# Altium schematic sheet FPGA programming.SchDoc: FPGA Configuration
size A4; Organization: Blinkinlabs, LLC; DocumentNumber: 12; SheetNumber: 13; SheetTotal: 14
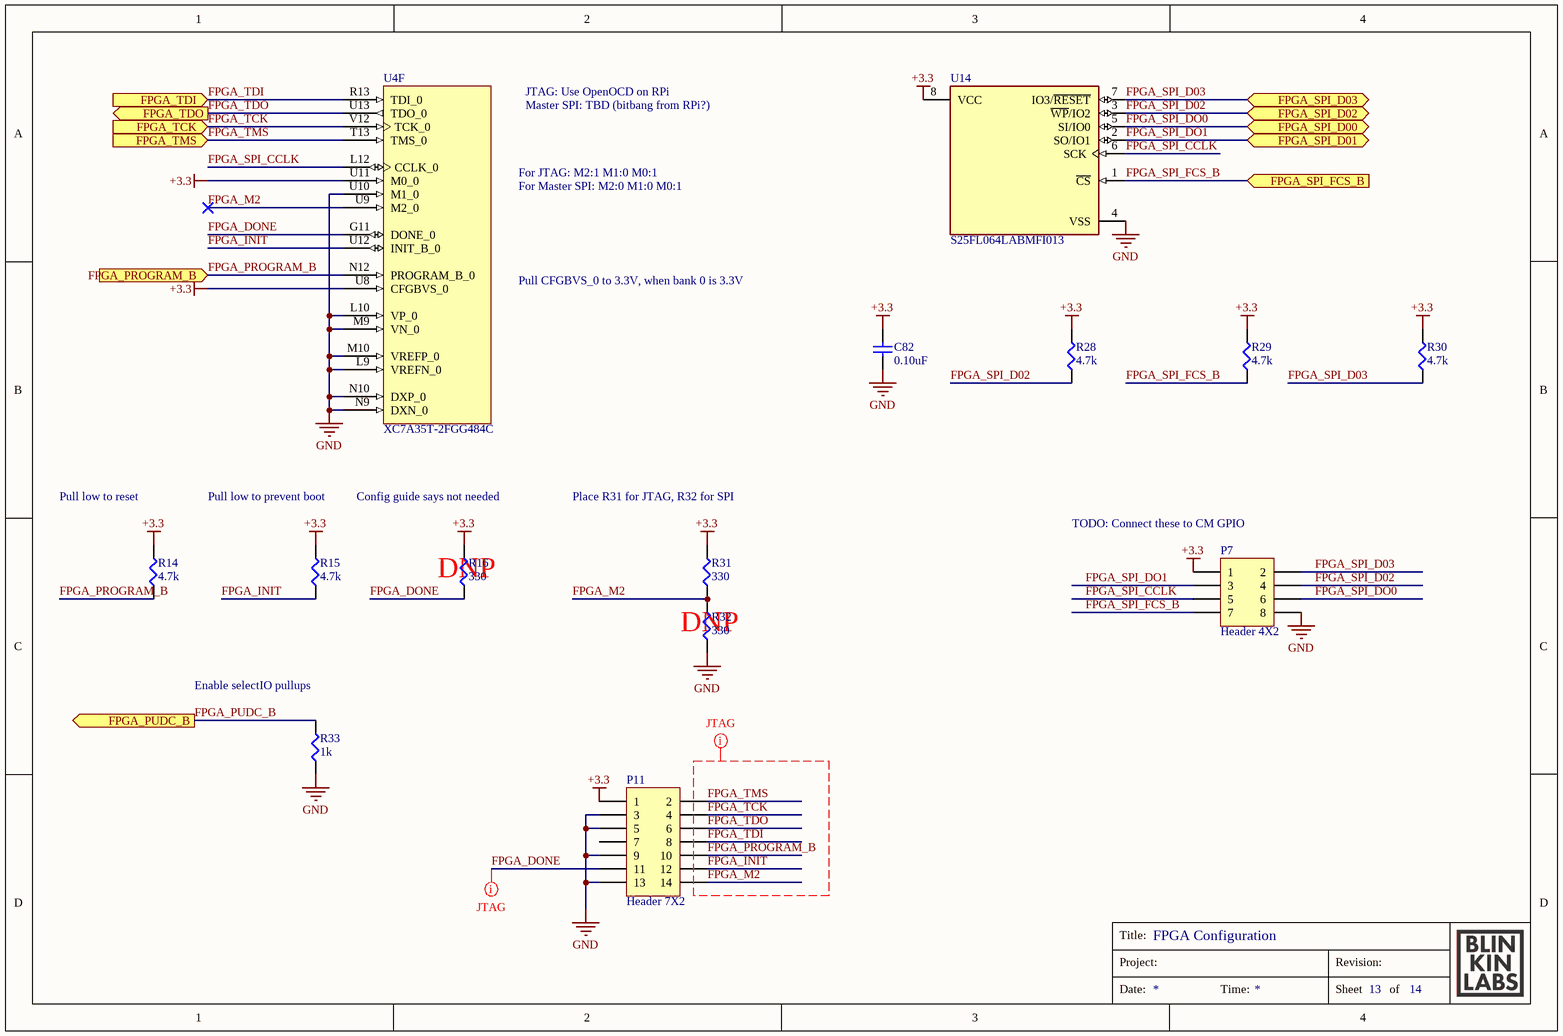
[diagram p0: FPGA programming.SchDoc]

## Parts
C82  0.10uF  [CAPC1005X06L]
P7  Header 4X2  [HDR2X4]
P11  Header 7X2  [HDR2X7]
R14  4.7k  [ERJ2G(0402)_L]
R15  4.7k  [ERJ2G(0402)_L]
R16  330  [ERJ2G(0402)_L]
R28  4.7k  [ERJ2G(0402)_L]
R29  4.7k  [ERJ2G(0402)_L]
R30  4.7k  [ERJ2G(0402)_L]
R31  330  [ERJ2G(0402)_L]
R32  330  [ERJ2G(0402)_L]
R33  1k  [ERJ2G(0402)_L]
U4  XC7A35T-2FGG484C  [FGG484]  (part F of 12)
U14  S25FL064LABMFI013  [FP-002-15548-MFG]

## Ports
FPGA_PROGRAM_B (in), FPGA_PUDC_B (out), FPGA_SPI_D00 (bidir), FPGA_SPI_D01 (bidir), FPGA_SPI_D02 (bidir), FPGA_SPI_D03 (bidir), FPGA_SPI_FCS_B (in), FPGA_TCK (in), FPGA_TDI (in), FPGA_TDO (out), FPGA_TMS (in)

## Nets
+3.3: C82.2 P7.1 P11.1 R14.2 R15.2 R16.2 R28.2 R29.2 R30.2 R31.2 U4.U8(CFGBVS_0) U4.U11(M0_0) U14.8(VCC)
GND: C82.1 P7.8 P11.3 P11.5 P11.9 P11.13 R32.1 R33.1 U4.L9(VREFN_0) U4.L10(VP_0) U4.M9(VN_0) U4.M10(VREFP_0) U4.N9(DXN_0) U4.N10(DXP_0) U4.U10(M1_0) U14.4(VSS)
FPGA_DONE: P11.11 R16.1 U4.G11(DONE_0)
FPGA_INIT: P11.12 R15.1 U4.U12(INIT_B_0)
FPGA_M2: P11.14 R31.1 R32.2 U4.U9(M2_0)
FPGA_PROGRAM_B: P11.10 R14.1 U4.N12(PROGRAM_B_0) ; port FPGA_PROGRAM_B
FPGA_PUDC_B: R33.2 ; port FPGA_PUDC_B
FPGA_SPI_CCLK: P7.5 U4.L12(CCLK_0) U14.6(SCK)
FPGA_SPI_D02: P7.4 R28.1 U14.3(~{WP}/IO2) ; port FPGA_SPI_D02
FPGA_SPI_D03: P7.2 R30.1 U14.7(IO3/~{RESET}) ; port FPGA_SPI_D03
FPGA_SPI_DO0: P7.6 U14.5(SI/IO0) ; port FPGA_SPI_D00
FPGA_SPI_DO1: P7.3 U14.2(SO/IO1) ; port FPGA_SPI_D01
FPGA_SPI_FCS_B: P7.7 R29.1 U14.1(~{CS}) ; port FPGA_SPI_FCS_B
FPGA_TCK: P11.4 U4.V12(TCK_0) ; port FPGA_TCK
FPGA_TDI: P11.8 U4.R13(TDI_0) ; port FPGA_TDI
FPGA_TDO: P11.6 U4.U13(TDO_0) ; port FPGA_TDO
FPGA_TMS: P11.2 U4.T13(TMS_0) ; port FPGA_TMS

Not connected (* = marked no-connect by the designer): P11 7

## Layout directives
net class JTAG: FPGA_DONE, FPGA_INIT, FPGA_M2, FPGA_PROGRAM_B, FPGA_TCK, FPGA_TDI, FPGA_TDO, FPGA_TMS

## Notes on the sheet
- JTAG: Use OpenOCD on RPi
- Master SPI: TBD (bitbang from RPi?)
- For JTAG: M2:1 M1:0 M0:1
- For Master SPI: M2:0 M1:0 M0:1
- Pull CFGBVS_0 to 3.3V, when bank 0 is 3.3V
- Pull low to reset
- Pull low to prevent boot
- Config guide says not needed
- Place R31 for JTAG, R32 for SPI
- (near R16) DNP
- (near P7) TODO: Connect these to CM GPIO
- (near R32) DNP
- (near R33) Enable selectIO pullups
- Title:
- Project:
- Revision:
- Date:
- Time:
- Sheet
- of

## Library data of the parts
C82 = GRM155R61A104KA01D: CAP CER 0.1UF 10V X5R 0402; Manufacturer: Murata Electronics North America; Tolerance: ±10%; PartNumber: GRM155R61A104KA01D; Datasheets: http://www.murata.com/~/media/webrenewal/support/library/catalog/products/capacitor/mlcc/c02e.pdf; Image: //media.digikey.com/Renders/Murata%20Renders/ZRB-SERIES-0402.jpg; Digi-Key Part Number: 490-1318-1-ND; Packaging: Cut Tape (CT); Series: GRM; Value: 0.10uF; Voltage: 10V; Temperature Coefficient: X5R; Operating Temperature: -55°C ~ 85°C; Features: -; Applications: General Purpose; Package / Case: 0402 (1005 Metric); Case/Package: 0402
P7 = Header 4X2: Header, 4-Pin, Dual row; LatestRevisionDate: 17-Jul-2002; LatestRevisionNote: Re-released for DXP Platform.; Publisher: Altium Limited
P11 = Header 7X2: Header, 7-Pin, Dual row; LatestRevisionDate: 17-Jul-2002; LatestRevisionNote: Re-released for DXP Platform.; Publisher: Altium Limited
R14 R15 R28-R30 = ERJ-PA2F4701X: RES SMD 4.7K OHM 1% 1/5W 0402; Manufacturer: Panasonic Electronic Components; Power (Watts): 0.2W, 1/5W; Temperature Coefficient: ±100ppm/°C; PartNumber: ERJ-PA2F4701X; Datasheets: https://industrial.panasonic.com/cdbs/www-data/pdf/RDA0000/AOA0000C243.pdf; Image: //media.digikey.com/Photos/Panasonic%20Photos/ERJ-PA2-Series.jpg; Digi-Key Part Number: P17228CT-ND; Series: ERJ; Value: 4.7k; Tolerance: ±1%; Composition: Thick Film; Features: Automotive AEC-Q200, Pulse Withstanding; Operating Temperature: -55°C ~ 155°C; Package / Case: 0402 (1005 Metric); Case/Package: 0402; Size / Dimension: 0.039" L x 0.020" W (1.00mm x 0.50mm); Height - Seated (Max): 0.016" (0.40mm); Number of Terminations: 2
R16 R31 R32 = ERJ-2RKF3300X: RES SMD 330 OHM 1% 1/10W 0402; Manufacturer: Panasonic Electronic Components; Power (Watts): 0.1W, 1/10W; Temperature Coefficient: ±100ppm/°C; PartNumber: ERJ-2RKF3300X; Datasheets: http://industrial.panasonic.com/www-cgi/jvcr13pz.cgi?E+PZ+3+AOA0002+ERJ2RKF3300X+7+WW; Image: //media.digikey.com/Photos/Panasonic%20Photos/ERJ-PA2-Series.jpg; Digi-Key Part Number: P330LCT-ND; Series: ERJ; Value: 330; Tolerance: ±1%; Composition: Thick Film; Features: Automotive AEC-Q200; Operating Temperature: -55°C ~ 155°C; Package / Case: 0402 (1005 Metric); Case/Package: 0402; Size / Dimension: 0.039" L x 0.020" W (1.00mm x 0.50mm); Height - Seated (Max): 0.016" (0.40mm); Number of Terminations: 2
R33 = ERJ-2RKF1001X: RES SMD 1K OHM 1% 1/10W 0402; Manufacturer: Panasonic Electronic Components; Power (Watts): 0.1W, 1/10W; Temperature Coefficient: ±100ppm/°C; PartNumber: ERJ-2RKF1001X; Datasheets: http://industrial.panasonic.com/www-cgi/jvcr13pz.cgi?E+PZ+3+AOA0002+ERJ2RKF1001X+7+WW; Image: //media.digikey.com/Photos/Panasonic%20Photos/ERJ-PA2-Series.jpg; Digi-Key Part Number: P1.00KLCT-ND; Series: ERJ; Value: 1k; Tolerance: ±1%; Composition: Thick Film; Features: Automotive AEC-Q200; Operating Temperature: -55°C ~ 155°C; Package / Case: 0402 (1005 Metric); Case/Package: 0402; Size / Dimension: 0.039" L x 0.020" W (1.00mm x 0.50mm); Height - Seated (Max): 0.016" (0.40mm); Number of Terminations: 2
U4 = CMP-0383-00019-1: Artix-7 FPGA, 250 User I/Os, 4 GTP, 484-Ball BGA, Speed Grade 2, Commercial Grade, Pb-Free; Manufacturer: Xilinx; Total Block RAM: 1800 Kb; GTP: 4; Available User I/O: 250; Speed Grades: 2; Logic Cells: 33280; CMTs: 5; ComponentLink3URL: http://www.xilinx.com/support/documentation/user_guides/ug475_7Series_Pkg_Pinout.pdf; PackageVersion: Rev. 1.11; ComponentLink2Description: Datasheet; ComponentLink3Description: Pinout; PartNumber: XC7A35T-2FGG484C; DatasheetVersion: Rev. 1.15; Operating Temperature Range: Commercial; PackageDescription: 484-Ball Wire-Bond Fine-Pitch BGA, Body 23 x 23 mm, Pitch 1 mm; ComponentLink4Description: Package Specification; Maximum Distributed RAM: 400 Kb; Mounting Technology: Surface Mount; ComponentLink2URL: http://www.xilinx.com/support/documentation/data_sheets/ds180_7Series_Overview.pdf; ComponentLink1Description: Manufacturer URL; ComponentLink4URL: http://www.xilinx.com/support/documentation/user_guides/ug475_7Series_Pkg_Pinout.pdf; PackageReference: FGG484; ComponentLink1URL: http://www.xilinx.com/
U14 = CMP-12948-000004-1: IC FLASH 64M SPI 108MHZ 8SOIC; Manufacturer: Cypress Semiconductor; Standoff Height: 0.05mm; Access Time: 8ns; Nominal Supply Current: 10-20mA; Max Supply Voltage: 3.6V; Memory Size: 64Mbits; Interface: SPI,Other; Memory Type: FLASH,NOR; Min Supply Voltage: 2.7V; Octopart: https://octopart.com/s25fl064labmfi013-cypress+semiconductor-81630477; Device Class L2: Memory; Frequency: 108MHz; Device Class L3: Flash; Digikey Description: IC FLASH 64M SPI 108MHZ 8SOIC; Device Class L1: Integrated Circuits (ICs); ComponentLink2URL: https://www.cypress.com/file/316661/download; ComponentLink2Description: Datasheet; Temperature Range High: +85°C; Temperature Range Low: -40°C; Ambient Temperature Range High: +85°C; Footprint Url: http://www.cypress.com/file/217366/download; RoHS: TRUE; Temperature: -40°C to +85°C; Package: 002-15548; Automotive: No; Lead Free: Yes; Mouser Description: IC FLASH NOR 8SOIC; Ambient Temperature Range Low: -40°C; Height: 2.16mm; Category: IC; Manufacturer Part Number: S25FL064LABMFI013